# Altium project DARKYDEN.PrjPcb (part 17 of 17)
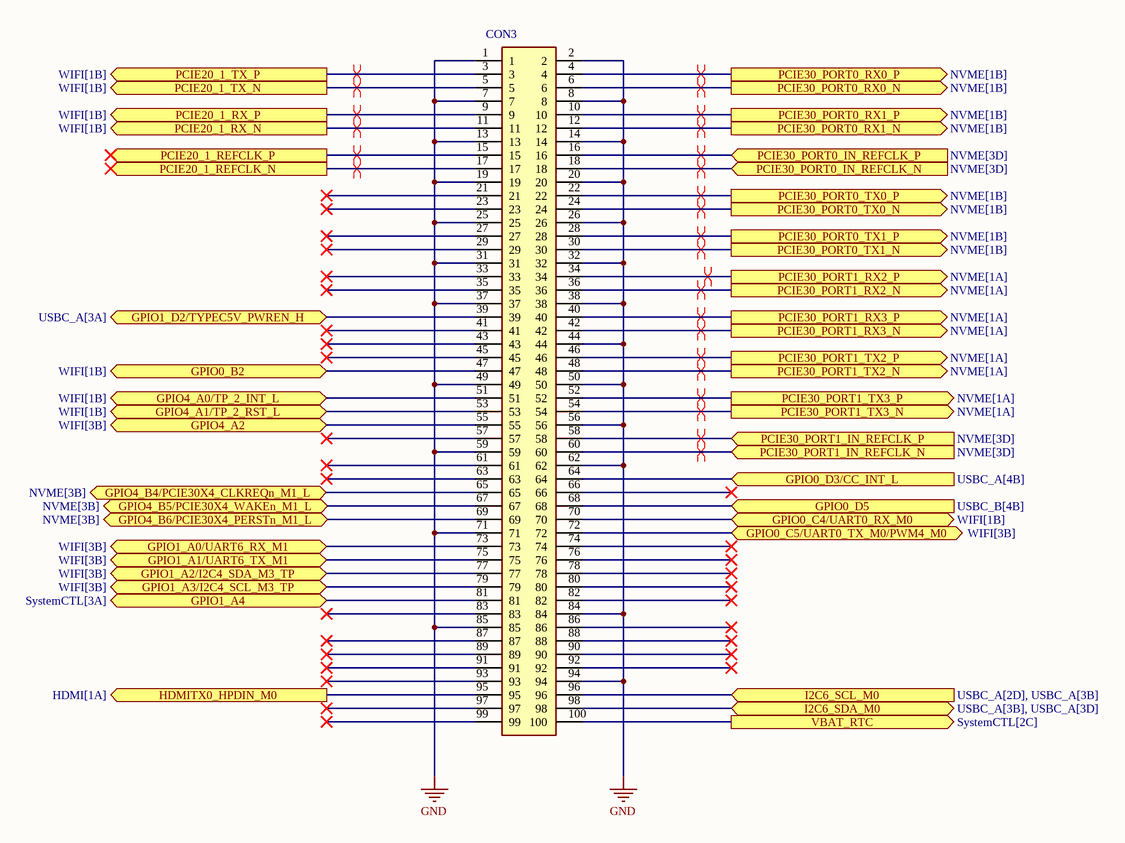
[diagram p17: CONNECTEUR_3.SchDoc]

## Nets that join several sheets
+1V8: SDCARD (R49.2), SystemCTL (5 pins)
+3V3: USBC_A (C9.2 R4.1 R5.1 U3.4), USBC_B (5 pins), NVME (R18.2 R22.2), ETHERNET (R14.2 R15.2), HDMI (6 pins), eDP (C21.2 U13.1), USB2_0 (7 pins), SystemCTL (R77.2)
+3V3_NVME: NVME (9 pins), POWER_PCie (7 pins)
+3V3_WIFI: WIFI (WIFI.2 WIFI.4 WIFI.72 WIFI.74), POWER_PCie (7 pins)
+5V: USBC_A (7 pins), USBC_B (7 pins), NVME (C26.2 U16.1), HDMI (8 pins), USB2_0 (IC18.5 IC18.7 IC19.7 IC20.7)
+12: eDP (eDP1.10 eDP1.11 eDP1.12), 12V_PWR (11 pins), POWER_PCie (R93.1 R94.1 R98.1 R99.1)
GND: USBC_A (32 pins), USBC_B (32 pins), WIFI (13 pins), NVME (41 pins), ETHERNET (7 pins), HDMI (24 pins), SDCARD (11 pins), eDP (18 pins), USB2_0 (32 pins), SystemCTL (15 pins), POWERSYSTEM (56 pins), BATTERY_GESTION (26 pins), 12V_PWR (24 pins), P3V3_PP5V_GESTION (17 pins), POWER_PCie (18 pins), CONNECTEUR_3 (24 pins)
P3V3: POWERSYSTEM (C87.2 U25.38), P3V3_PP5V_GESTION (C152.2 IC16.5)
PACK+: POWERSYSTEM (7 pins), BATTERY_GESTION (12 pins)
PP5V: POWERSYSTEM (U25.34 U25.35), P3V3_PP5V_GESTION (8 pins)
VCC_SYS: POWERSYSTEM (8 pins), 12V_PWR (10 pins), P3V3_PP5V_GESTION (5 pins)
GPIO0_B2: WIFI (WIFI.21), CONNECTEUR_3 (CON3.47)
GPIO0_C4/UART0_RX_M0: WIFI (R41.1), CONNECTEUR_3 (CON3.70)
GPIO0_C5/UART0_TX_M0/PWM4_M0: WIFI (WIFI.20), CONNECTEUR_3 (CON3.72)
GPIO0_D3/CC_INT_L: USBC_A (U3.5), CONNECTEUR_3 (CON3.64)
GPIO0_D5: USBC_B (R13.1 U9.5), CONNECTEUR_3 (CON3.68)
GPIO1_A0/UART6_RX_M1: WIFI (WIFI.22), CONNECTEUR_3 (CON3.73)
GPIO1_A1/UART6_TX_M1: WIFI (WIFI.32), CONNECTEUR_3 (CON3.75)
GPIO1_A2/I2C4_SDA_M3_TP: WIFI (WIFI.36), CONNECTEUR_3 (CON3.77)
GPIO1_A3/I2C4_SCL_M3_TP: WIFI (WIFI.34), CONNECTEUR_3 (CON3.79)
GPIO1_A4: SystemCTL (IC4.2), CONNECTEUR_3 (CON3.81)
GPIO1_D2/TYPEC5V_PWREN_H: USBC_A (R1.2 U2.4), CONNECTEUR_3 (CON3.39)
GPIO4_A0/TP_2_INT_L: WIFI (WIFI.53), CONNECTEUR_3 (CON3.51)
GPIO4_A1/TP_2_RST_L: WIFI (WIFI.55), CONNECTEUR_3 (CON3.53)
GPIO4_A2: WIFI (WIFI.52), CONNECTEUR_3 (CON3.55)
GPIO4_B4/PCIE30X4_CLKREQn_M1_L: NVME (R20.2), CONNECTEUR_3 (CON3.65)
GPIO4_B5/PCIE30X4_WAKEn_M1_L: NVME (R21.2), CONNECTEUR_3 (CON3.67)
GPIO4_B6/PCIE30X4_PERSTn_M1_L: NVME (R19.2), CONNECTEUR_3 (CON3.69)
HDMITX0_HPDIN_M0: HDMI (Q4.3 R51.1), CONNECTEUR_3 (CON3.95)
I2C6_SCL_M0: USBC_A (R4.2 U3.6), CONNECTEUR_3 (CON3.96)
I2C6_SDA_M0: USBC_A (R5.2 U3.7), CONNECTEUR_3 (CON3.98)
PCIE20_1_RX_N: WIFI (WIFI.43), CONNECTEUR_3 (CON3.11)
PCIE20_1_RX_P: WIFI (WIFI.41), CONNECTEUR_3 (CON3.9)
PCIE20_1_TX_N: WIFI (WIFI.37), CONNECTEUR_3 (CON3.5)
PCIE20_1_TX_P: WIFI (WIFI.35), CONNECTEUR_3 (CON3.3)
PCIE30_PORT0_IN_REFCLK_N: NVME (R35.2 R37.1), CONNECTEUR_3 (CON3.18)
PCIE30_PORT0_IN_REFCLK_P: NVME (R34.2 R38.1), CONNECTEUR_3 (CON3.16)
PCIE30_PORT0_RX0_N: NVME (NVME.41), CONNECTEUR_3 (CON3.6)
PCIE30_PORT0_RX0_P: NVME (NVME.43), CONNECTEUR_3 (CON3.4)
PCIE30_PORT0_RX1_N: NVME (NVME.29), CONNECTEUR_3 (CON3.12)
PCIE30_PORT0_RX1_P: NVME (NVME.31), CONNECTEUR_3 (CON3.10)
PCIE30_PORT0_TX0_N: NVME (NVME.47), CONNECTEUR_3 (CON3.24)
PCIE30_PORT0_TX0_P: NVME (NVME.49), CONNECTEUR_3 (CON3.22)
PCIE30_PORT0_TX1_N: NVME (NVME.35), CONNECTEUR_3 (CON3.30)
PCIE30_PORT0_TX1_P: NVME (NVME.37), CONNECTEUR_3 (CON3.28)
PCIE30_PORT1_IN_REFCLK_N: NVME (R33.2 R39.1), CONNECTEUR_3 (CON3.60)
PCIE30_PORT1_IN_REFCLK_P: NVME (R32.2 R40.1), CONNECTEUR_3 (CON3.58)
PCIE30_PORT1_RX2_N: NVME (NVME.17), CONNECTEUR_3 (CON3.36)
PCIE30_PORT1_RX2_P: NVME (NVME.19), CONNECTEUR_3 (CON3.34)
PCIE30_PORT1_RX3_N: NVME (NVME.5), CONNECTEUR_3 (CON3.42)
PCIE30_PORT1_RX3_P: NVME (NVME.7), CONNECTEUR_3 (CON3.40)
PCIE30_PORT1_TX2_N: NVME (NVME.23), CONNECTEUR_3 (CON3.48)
PCIE30_PORT1_TX2_P: NVME (NVME.25), CONNECTEUR_3 (CON3.46)
PCIE30_PORT1_TX3_N: NVME (NVME.11), CONNECTEUR_3 (CON3.54)
PCIE30_PORT1_TX3_P: NVME (NVME.13), CONNECTEUR_3 (CON3.52)
VBAT_RTC: SystemCTL (RTC_BAT.1), CONNECTEUR_3 (CON3.100)
WIFI_REFCLK_A_N: WIFI (WIFI.49), NVME (R119.2 R159.1)
WIFI_REFCLK_A_P: WIFI (WIFI.47), NVME (R118.2 R121.1)